# EAGLE design TiLDE (EAGLE 6.1)
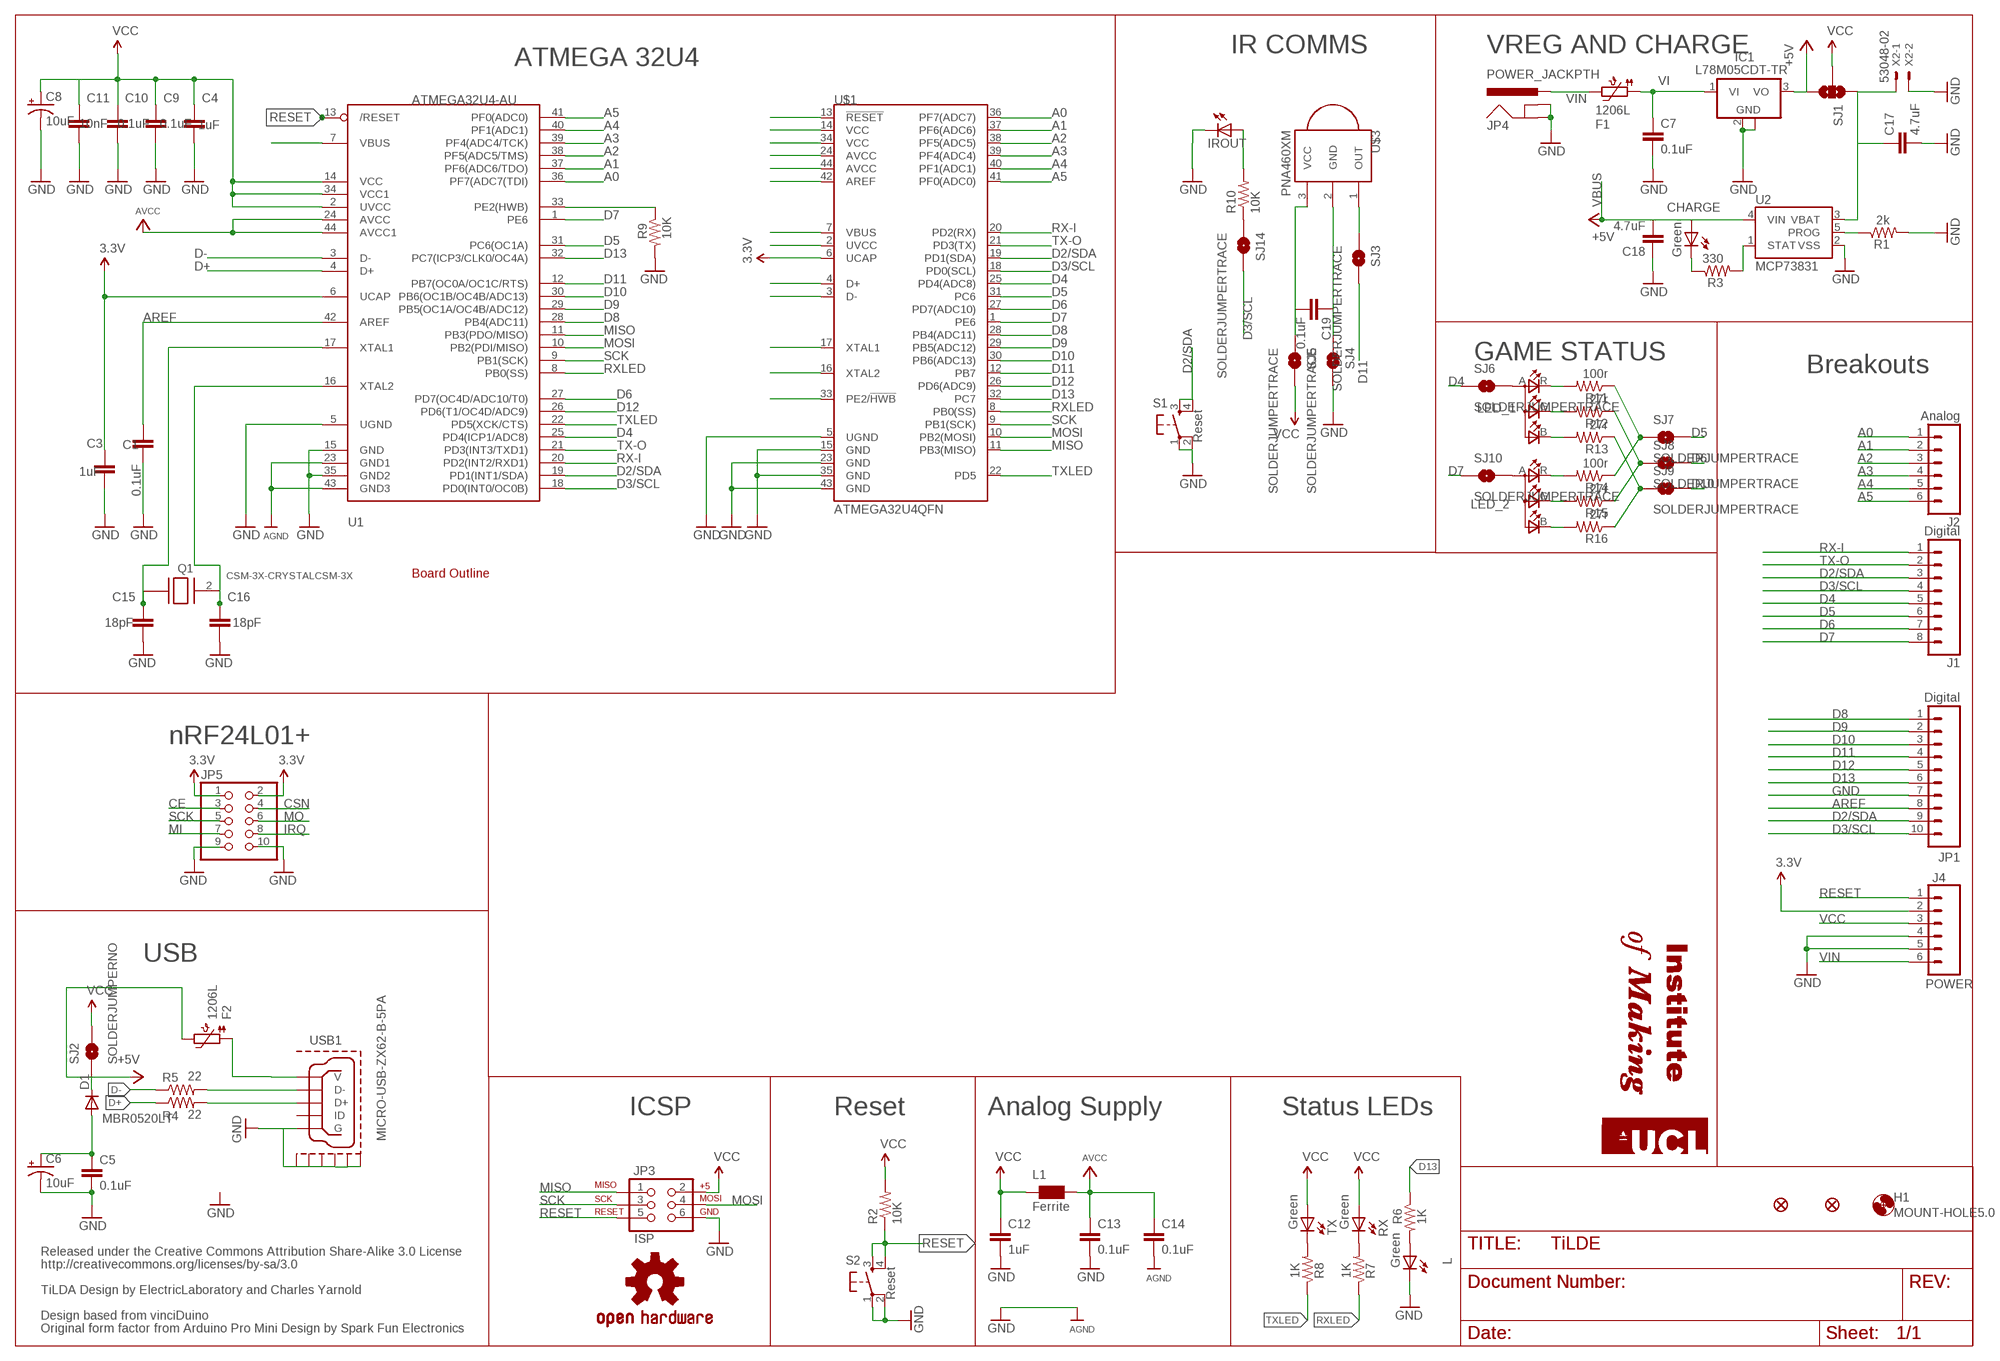
[diagram p0: schematic, sheet 1]

## Parts
C1  0.1uF  C-EUC0603K  [C0603K]
C3  1uF  C-EUC0603K  [C0603K]
C4  1uF  C-EUC0603K  [C0603K]
C5  0.1uF  C-EUC0603K  [C0603K]
C6  10uF  CAP_POL1206  [EIA3216]
C7  0.1uF  C-EUC0603K  [C0603K]
C8  10uF  CAP_POL1206  [EIA3216]
C9  0.1uF  C-EUC0603K  [C0603K]
C10  0.1uF  C-EUC0603K  [C0603K]
C11  10nF  C-EUC0603K  [C0603K]
C12  1uF  C-EUC0603K  [C0603K]
C13  0.1uF  C-EUC0603K  [C0603K]
C14  0.1uF  C-EUC0603K  [C0603K]
C15  18pF  C-EUC0603K  [C0603K]
C16  18pF  C-EUC0603K  [C0603K]
C17  4.7uF  C-EUC0603K  [C0603K]
C18  4.7uF  C-EUC0603K  [C0603K]
C19  0.1uF  C-EUC0603K  [C0603K]
CHARGE  Green  LED1206  [LED-1206]
D1  MBR0520LT  [SOD123]
F1  1206L  PTC1206_L  [1206_PTC]
F2  1206L  PTC1206_L  [1206_PTC]
H1  MOUNT-HOLE5.0  [5,0]
IC1  L78M05CDT-TR  78XX  [SOT-223-DPAK]
IROUT  LED5MM  [LED5MM]
J1  Digital  M081X08  [1X08]
J2  Analog  M06SIP  [1X06]
J4  POWER  M06SIP  [1X06]
JP1  Digital  M10"  [1X10]
JP2  FIDUCIAL1X2.5  [FIDUCIAL-1X2.5]
JP3  ISP  AVR_SPI_PRG_6PTH  [2X3]
JP4  POWER_JACKPTH  [POWER_JACK_PTH]
JP5  PINHD-2X5  [2X05]
JP6  FIDUCIAL1X2.5  [FIDUCIAL-1X2.5]
L  Green  LED1206  [LED-1206]
L1  Ferrite  WE-CBF_1206W  [1206W]
LED_1  CLV1A-FKB  [CLV1A-FKB]
LED_2  CLV1A-FKB  [CLV1A-FKB]
Q1  CSM-3X-CRYSTALCSM-3X  [CSM-3X]
R1  2k  RESISTOR0603-RES  [0603-RES]
R2  10K  RESISTOR0603-RES  [0603-RES]
R3  330  RESISTOR0603-RES  [0603-RES]
R4  22  RESISTOR0603-RES  [0603-RES]
R5  22  RESISTOR0603-RES  [0603-RES]
R6  1K  RESISTOR0603-RES  [0603-RES]
R7  1K  RESISTOR0603-RES  [0603-RES]
R8  1K  RESISTOR0603-RES  [0603-RES]
R9  10K  RESISTOR0603-RES  [0603-RES]
R10  10K  RESISTOR0603-RES  [0603-RES]
R11  100r  RESISTOR0603-RES  [0603-RES]
R12  27r  RESISTOR0603-RES  [0603-RES]
R13  27r  RESISTOR0603-RES  [0603-RES]
R14  100r  RESISTOR0603-RES  [0603-RES]
R15  27r  RESISTOR0603-RES  [0603-RES]
R16  27r  RESISTOR0603-RES  [0603-RES]
RX  Green  LED1206  [LED-1206]
S1  Reset  TAC_SWITCHSMD  [TACTILE_SWITCH_SMD]
S2  Reset  TAC_SWITCHSMD  [TACTILE_SWITCH_SMD]
SJ1  SOLDERJUMPER_2WAYT  [SJ_2]
SJ2  SOLDERJUMPERNO  [SJ_2S-NO]
SJ3  SOLDERJUMPERTRACE  [SJ_2S-TRACE]
SJ4  SOLDERJUMPERTRACE  [SJ_2S-TRACE]
SJ5  SOLDERJUMPERTRACE  [SJ_2S-TRACE]
SJ6  SOLDERJUMPERTRACE  [SJ_2S-TRACE]
SJ7  SOLDERJUMPERTRACE  [SJ_2S-TRACE]
SJ8  SOLDERJUMPERTRACE  [SJ_2S-TRACE]
SJ9  SOLDERJUMPERTRACE  [SJ_2S-TRACE]
SJ10  SOLDERJUMPERTRACE  [SJ_2S-TRACE]
SJ14  SOLDERJUMPERTRACE  [SJ_2S-TRACE]
TX  Green  LED1206  [LED-1206]
U1  ATMEGA32U4-AU  [TQFP44]
U2  MCP73831  [SOT23-5]
U$1  ATMEGA32U4QFN  [QFN-44]
U$2  UCL-LOGO  [UCL-LOGO]
U$3  PNA460XM  [PNA460XM]
U$5  BOARDOUTLINE  [BADGEBOARDBARE]
U$14  OSHW-LOGOS  [OSHW-LOGO-S]
USB1  MICRO-USB-ZX62-B-5PA  [ZX62-B-5PA]
X2  53048-02  [53048-02]

## Nets
3.3V: C3.1 J4.2 JP5.1 JP5.2 U1.6(UCAP) U$1.6(UCAP)
+5V: IC1.3(VO) SJ1.3
A0: J2.1 JP5.3 U1.36(PF7(ADC7(TDI)) U$1.36(PF7(ADC7))
A1: J2.2 JP5.4 U1.37(PF6(ADC6/TDO)) U$1.37(PF6(ADC6))
A2: J2.3 U1.38(PF5(ADC5/TMS)) U$1.38(PF5(ADC5))
A3: J2.4 U1.39(PF4(ADC4/TCK)) U$1.39(PF4(ADC4))
A4: J2.5 U1.40(PF1(ADC1)) U$1.40(PF1(ADC1))
A5: J2.6 U1.41(PF0(ADC0)) U$1.41(PF0(ADC0))
AREF: C1.2 JP1.8 U1.42(AREF) U$1.42(AREF)
AVCC: C13.1 C14.1 L1.2 U1.24(AVCC) U1.44(AVCC1) U$1.24(AVCC) U$1.44(AVCC)
D2: JP5.8
D2/SDA: J1.3 JP1.9 S1.3 S1.4 U1.19(PD1(INT1/SDA)) U$1.19(PD1(SDA))
D3/SCL: J1.4 JP1.10 SJ14.2 U1.18(PD0(INT0/OC0B)) U$1.18(PD0(SCL))
D4: J1.5 SJ6.1 U1.25(PD4(ICP1/ADC8)) U$1.25(PD4(ADC8))
D5: J1.6 SJ7.2 U1.31(PC6(OC1A)) U$1.31(PC6)
D6: J1.7 SJ8.2 U1.27(PD7(OC4D/ADC10/T0)) U$1.27(PD7(ADC10))
D7: J1.8 SJ10.1 U1.1(PE6) U$1.1(PE6)
D8: JP1.1 U1.28(PB4(ADC11)) U$1.28(PB4(ADC11))
D9: JP1.2 U1.29(PB5(OC1A/OC4B/ADC12)) U$1.29(PB5(ADC12))
D10: JP1.3 SJ9.2 U1.30(PB6(OC1B/OC4B/ADC13)) U$1.30(PB6(ADC13))
D11: JP1.4 SJ3.2 U1.12(PB7(OC0A/OC1C/RTS)) U$1.12(PB7)
D12: JP1.5 U1.26(PD6(T1/OC4D/ADC9)) U$1.26(PD6(ADC9))
D13: JP1.6 R6.1 U1.32(PC7(ICP3/CLK0/OC4A)) U$1.32(PC7)
D+: R4.1 U1.4(D+) U$1.4(D+)
D-: R5.1 U1.3(D-) U$1.3(D-)
GND: C1.1 C3.2 C4.2 C5.2 C6.C(-) C7.2 C8.C(-) C9.2 C10.2 C11.2 C12.2 C13.2 C14.2 C15.2 C16.2 C17.2 C18.1 IC1.2(GND) IC1.4(GND) IROUT.K(C) J4.4 J4.5 JP1.7 JP3.6 JP4.GND JP4.GNDBREAK JP5.9 JP5.10 L.C R1.2 R9.2 S1.1 S1.2 S2.1 S2.2 SJ4.2 U1.5(UGND) U1.15(GND) U1.23(GND1) U1.35(GND2) U1.43(GND3) U2.2(VSS) U$1.5(UGND) U$1.15(GND) U$1.23(GND) U$1.35(GND) U$1.43(GND) USB1.5(G) USB1.GND@1(GND1) USB1.GND@2(GND2) USB1.GND@3(GND3) USB1.GND@4(GND4) USB1.GND@5(GND5) USB1.GND@6(GND6) X2.2 ; supply symbol labelled AGND
HWB: R9.1 U1.33(PE2(HWB)) U$1.33(PE2/!HWB)
MISO: JP3.1 JP5.7 U1.11(PB3(PDO/MISO)) U$1.11(PB3(MISO))
MOSI: JP3.4 JP5.6 U1.10(PB2(PDI/MISO)) U$1.10(PB2(MOSI))
N$1: R8.2 TX.C
N$2: R5.2 USB1.2(D-)
N$3: C19.1 SJ4.1 U$3.2(GND)
N$4: C19.2 SJ5.1 U$3.3(VCC)
N$5: R4.2 USB1.3(D+)
N$6: SJ3.1 U$3.1(OUT)
N$7: L.A R6.2
N$8: C17.1 SJ1.1 U2.3(VBAT) X2.1
N$9: R7.2 RX.C
N$10: R1.1 U2.5(PROG)
N$11: R3.2 U2.1(STAT)
N$12: CHARGE.C R3.1
N$13: F2.1 USB1.1(V)
N$14: LED_1.R(CRED) R11.2
N$15: LED_1.G(CGREEN) R12.2
N$16: LED_1.B(CBLUE) R13.2
N$17: LED_2.R(CRED) R14.2
N$18: LED_2.G(CGREEN) R15.2
N$19: LED_2.B(CBLUE) R16.2
N$20: R11.1 R14.1 SJ7.1
N$21: R12.1 R15.1 SJ8.1
N$22: R13.1 R16.1 SJ9.1
N$23: LED_2.A(ANODE) SJ10.2
N$24: C5.1 C6.A(+) D1.A
N$27: LED_1.A(ANODE) SJ6.2
N$28: R10.1 SJ14.1
N$29: IROUT.A R10.2
RESET: J4.1 JP3.5 R2.1 S2.3 S2.4 U1.13(/RESET) U$1.13(!RESET)
RX-I: J1.1 U1.20(PD2(INT2/RXD1)) U$1.20(PD2(RX))
RXLED: R7.1 U1.8(PB0(SS)) U$1.8(PB0(SS))
SCK: JP3.3 JP5.5 U1.9(PB1(SCK)) U$1.9(PB1(SCK))
TX-O: J1.2 U1.21(PD3(INT3/TXD1)) U$1.21(PD3(TX))
TXLED: R8.1 U1.22(PD5(XCK/CTS)) U$1.22(PD5)
VBUS: C18.2 CHARGE.A D1.C F2.2 SJ2.1 U1.7(VBUS) U2.4(VIN) U$1.7(VBUS) ; supply symbol labelled +5V
VCC: C4.1 C8.A(+) C9.1 C10.1 C11.1 C12.1 J4.3 JP3.2 L1.1 R2.2 RX.A SJ1.2 SJ2.2 SJ5.2 TX.A U1.2(UVCC) U1.14(VCC) U1.34(VCC1) U$1.2(UVCC) U$1.14(VCC) U$1.34(VCC)
VI [vcc]: C7.1 F1.1 IC1.1(VI)
VIN [vcc]: F1.2 J4.6 JP4.PWR
XTAL1: C15.1 Q1.1 U1.17(XTAL1) U$1.17(XTAL1)
XTAL2: C16.1 Q1.2 U1.16(XTAL2) U$1.16(XTAL2)
Unconnected: USB1.4(ID)

## Notes on the sheet
- IR COMMS | VREG AND CHARGE
- ATMEGA 32U4
- VBUS
- GAME STATUS
- Breakouts
- nRF24L01+
- CE | CSN
- SCK | MO
- MI | IRQ
- USB
- ICSP | Reset | Analog Supply | Status LEDs
- Released under the Creative Commons Attribution Share-Alike 3.0 License
- http://creativecommons.org/licenses/by-sa/3.0
- TiLDA Design by ElectricLaboratory and Charles Yarnold
- Design based from vinciDuino
- Original form factor from Arduino Pro Mini Design by Spark Fun Electronics

## Library data of the parts
C1 C3-C5 C7 C9-C19 = resistor:C-EU: CAPACITOR, European symbol
C6 C8 = SparkFun:CAP_POL: Capacitor Polarized These are standard SMD and PTH capacitors. Normally 10uF, 47uF, and 100uF in electrolytic and tantalum varieties. Always verify the external diameter of the through hole cap, it varies with capacity, voltage, and manufacturer. The EIA devices should be standard.
CHARGE L RX TX = SparkFun:LED: LEDs Standard schematic elements and footprints for 5mm, 3mm, 1206, and 0603 sized LEDs. 5mm - Spark Fun Electronics SKU : COM-00529 (and others)
D1 = diode:MBR0520LT: SCHOTTKY BARRIER RECTIFIER Source: http://onsemi.com .. MBR0520LT1-D.pdf
F1 F2 = microbuilder:PTC: PTC (Resettable Fuse) 1206 Package 250mA PTC (16V Max, Time-to-Trip: 0.08s) - Digikey: F2110CT-ND 1210 Package 100mA PTC (30V Max, Time-to-Trip: 0.6s) - Digikey: MF-USMF010-2CT-ND 1812 Package 750mA PTC (24V Max, Time-to-Trip: 0.2s) - Digikey: MF-MSMF075/24-2CT-ND
H1 = holes:MOUNT-HOLE: MOUNTING HOLE with drill center marker
IC1 = fmc:78XX
IROUT = SparkFun-LED:LED: LEDs Standard schematic elements and footprints for 5mm, 3mm, 1206, and 0603 sized LEDs. 5mm - Spark Fun Electronics SKU : COM-00529 (and others)
J1 = SparkFun:M08: Header 8 Standard 8-pin 0.1" header. Use with straight break away headers (SKU : PRT-00116), right angle break away headers (PRT-00553), swiss pins (PRT-00743), machine pins (PRT-00117), and female headers (PRT-00115).
J2 J4 = SparkFun:M06: Header 6 Standard 6-pin 0.1" header. Use with straight break away headers (SKU : PRT-00116), right angle break away headers (PRT-00553), swiss pins (PRT-00743), machine pins (PRT-00117), and female headers (PRT-00115). Molex polarized connector foot print use with SKU : PRT-08094 with associated crimp pins and housings. NOTES ON THE VARIANTS LOCK and LOCK_LONGPADS... This footprint was designed to help hold the alignment of a through-hole component (i.e. 6-pin header) while soldering it into place. You may notice that each hole has been shifted either up or down by 0.005 of an inch from it's more standard position (which is a perfectly straight line). This slight alteration caused the pins (the squares in the middle) to touch the edges of the holes. Because they are alternating, it causes a "brace" to hold the component in place. 0.005 has proven to be the perfect amount of "off-center" position when using our standard breakaway headers. Although looks a little odd when you look at the bare footprint, once you have a header in there, the alteration is very hard to notice. Also, if you push a header all the way into place, it is covered up entirely on the bottom side. This idea of altering the position of holes to aid alignment will be further integrated into the Sparkfun Library for other footprints. It can help hold any component with 3 or more connection pins.
JP1 = SparkFun:M10: Header 10 Standard 10-pin 0.1" header. Use with straight break away headers (SKU : PRT-00116), right angle break away headers (PRT-00553), swiss pins (PRT-00743), machine pins (PRT-00117), and female headers (PRT-00115).
JP2 JP6 = SparkFun-Aesthetics:FIDUCIAL: Fiducial Alignment Points Various fiducial points for machine vision alignment.
JP3 = SparkFun:AVR_SPI_PRG_6: AVR ISP 6 Pin This is the reduced ISP connector for AVR programming. Common on Arduino. This footprint will take up less PCB space and can be used with a 10-pin to 6-pin adapter such as SKU: BOB-08508
JP4 = SparkFun:POWER_JACK: Power Jack This is the standard 5.5mm barrel jack for power. The PTH is the most common, proven, reliable, footprint. All others are experimental. The Slot footprint only works if the mill layer is transmitted to the PCB fab house so be warned. Spark Fun Electronics SKU : PRT-00119. Mating wall wart : TOL-00298 (and others)
JP5 = pinhead:PINHD-2X5: PIN HEADER
L1 = wuerth-elektronik:WE-CBF: SMD EMI Suppression Ferrite Beads - excellent anti-EMI properties - low DCR - impedances till 3000 ohms - rated current up to 6 A
LED_1 LED_2 = led-rgb:CLV1A-FKB: Chip LED RGB Source: http://document.sharpsma.com/files/GM1WA55311A_SS.pdf
Q1 = fmc:CSM-3X-CRYSTAL
R1-R16 = SparkFun-Passives:RESISTOR: Resistor Basic schematic elements and footprints for 0603, 1206, and PTH resistors.
S1 S2 = SparkFun:TAC_SWITCH: Momentary Switch Button commonly used for reset or general input. Spark Fun Electronics SKU : COM-00097
SJ1 = SparkFun-Passives:SOLDERJUMPER_2WAY: Solder Jumper 2 way solder jumper
SJ2-SJ10 SJ14 = SparkFun-Passives:SOLDERJUMPER: Solder Jumper Standard SMD solder jumper. Used to automate production. Two varients : Normally Open and Normally Closed are the same, but have different paste layers. NC will have a large amount of paste and should jumper during reflow.
U1 = adafruit:ATMEGA32U4: http://www.ladyada.net/library/eagle
U2 = SparkFun-PowerIC:MCP73831: Miniature single cell, fully integrated Li-Ion, Li-polymer charge management controller http://ww1.microchip.com/downloads/en/DeviceDoc/21984a.pdf
U$1 = SparkFun-DigitalIC:ATMEGA32U4: Atmel 44-pin 8-bit Microcontroller with 32KBytes of ISP Flash and USB Controller
U$2 = TiLDA:UCL-LOGO
U$3 = adafruit:PNA460XM: IR 38KHz receiver PNA4602 and related receivers http://www.ladyada.net/library/pcb/eaglelibrary.html
U$5 = TiLDA:BOARDOUTLINE
U$14 = SparkFun:OSHW-LOGO: Open Source Hardware Logo This logo indicates the piece of hardware it is found on incorporates a OSHW license and/or adheres to the definition of open source hardware found here: http://freedomdefined.org/OSHW
USB1 = serial:MICRO-USB: MICRO USB B, BOTTOM MOUNT
X2 = con-molex:53?-02: CONNECTOR wire to board 1.25 mm (.049 inch) pitch header; MF: MOLEX; MPN: 53048-0210; OC_FARNELL: 1012259; OC_NEWARK: 57H4718

## Net classes
1 vcc: width 0.254 mm

## Board
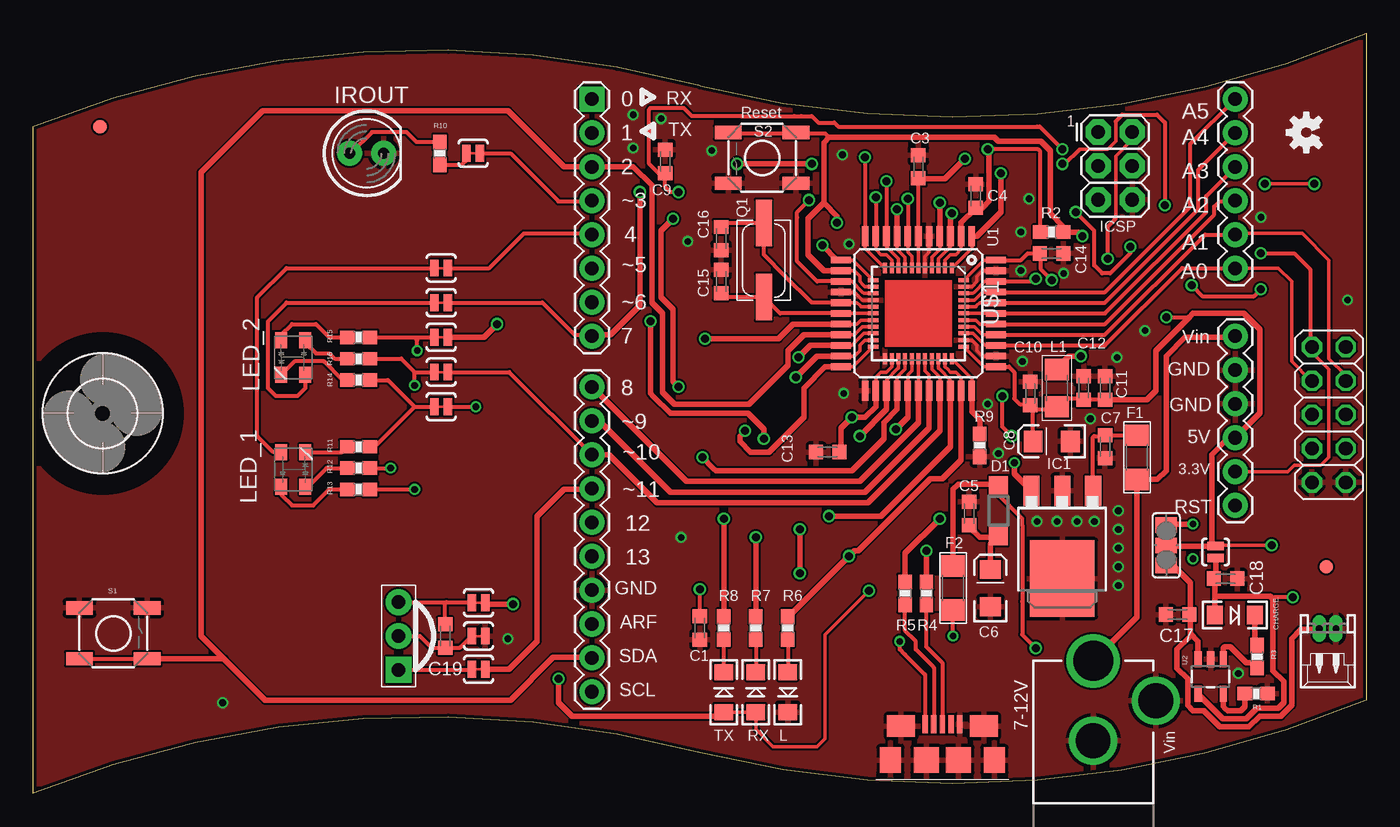
[diagram p1: board, top side]
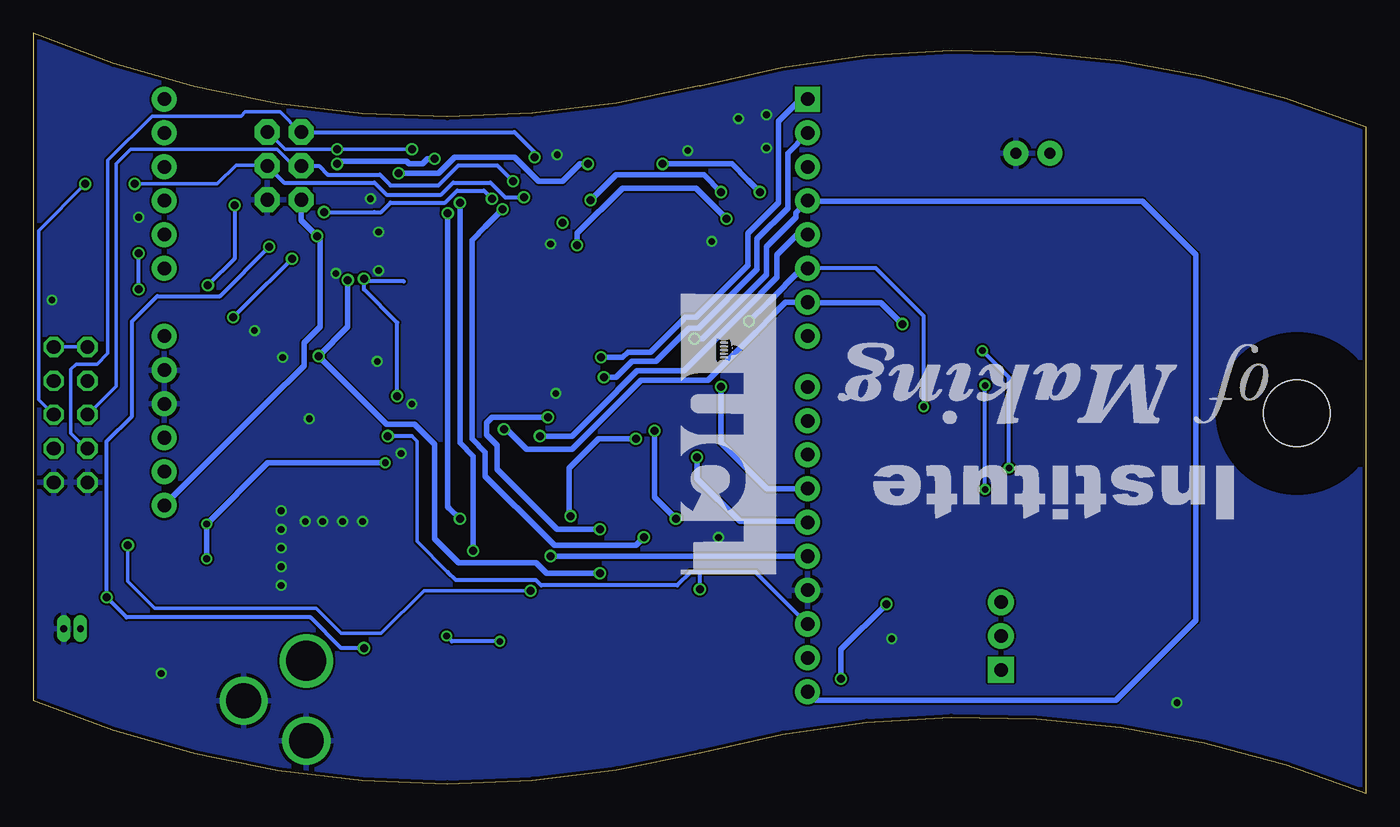
[diagram p2: board, bottom side, seen from below]

Size 100 x 57 mm. Coordinates in mm from the lower left corner, seen from the top.
Copper layers (1*16): Top 0.035mm / dielectric 1.5mm / Bottom 0.035mm
Design rules: minimum track width 6mil, minimum drill 12mil, track to track 6mil, track to pad 6mil, pad to pad 6mil, via to via 6mil, smd to smd 0mil, copper to edge 10mil, drill to drill 10mil, minimum pad ring 10mil, minimum via ring 6mil, stop-mask expansion 2mil, vias tented up to drill 100mil, thermal gap 10mil

### Footprints (pad centres in the part's own frame; a part is rotated, then mirrored left to right if it is on the bottom)
C0603K = smd 1.05 x 1.08: 1 -0.875,0; 2 0.875,0
EIA3216 = smd 1.4 x 1.6: A 1.4,0; C -1.4,0
LED-1206 = smd 1.2 x 1.4: A -1.5,0; C 1.5,0
SOD123 = smd 1.4 x 1.4: A 1.9,0; C -1.9,0
1206_PTC = smd 1.6 x 1.8: 1 -1.654,0; 2 1.654,0
5,0 = hole 5: 0,0
SOT-223-DPAK = smd 1.219 x 2.235: 1 -2.311,-3.099; 2 0,-3.099; 3 2.311,-3.099 | smd 4.826 x 5.715: 4 0,3.493
LED5MM = drill 0.813 pad 1.88: A -1.27,0; K 1.27,0
1X08@1 = drill 1.016 pad 1.88 square: 1 0,0 | drill 1.016 pad 1.88: 2 2.54,0; 3 5.08,0; 4 7.62,0; 5 10.16,0; 6 12.7,0; 7 15.24,0; 8 17.78,0
1X06@1 = drill 1.016 pad 1.88: 1 -6.35,0; 2 -3.81,0; 3 -1.27,0; 4 1.27,0; 5 3.81,0; 6 6.35,0
1X10 = drill 1.016 pad 1.88: 1 0,0; 2 2.54,0; 3 5.08,0; 4 7.62,0; 5 10.16,0; 6 12.7,0; 7 15.24,0; 8 17.78,0; 9 20.32,0; 10 22.86,0
FIDUCIAL-1X2.5 = smd 1 x 1: 1 0,0
2X3@1 = drill 1.016 pad 1.88 octagon: 1 0,0; 2 0,2.54; 3 2.54,0; 4 2.54,2.54; 5 5.08,0; 6 5.08,2.54
POWER_JACK_PTH@1 = drill 2.6: GND 0,7.7; GNDBREAK 4.7,10.7 | drill 3: PWR 0,13.7
2X05 = drill 1.016 octagon: 1 -5.08,-1.27; 2 -5.08,1.27; 3 -2.54,-1.27; 4 -2.54,1.27; 5 0,-1.27; 6 0,1.27; 7 2.54,-1.27; 8 2.54,1.27; 9 5.08,-1.27; 10 5.08,1.27
1206W = smd 1.6 x 1.8: 1 -1.4,0; 2 1.4,0
CLV1A-FKB = smd 1.2 x 0.9: A 0.4,-0.4; B 3,-0.4; G 3,1.4; R 0.4,1.4
CSM-3X = smd 3.5 x 1.2: 1 2.775,0; 2 -2.775,0
0603-RES = smd 1.1 x 1: 1 -0.85,0; 2 0.85,0
TACTILE_SWITCH_SMD = smd 2 x 1: 1 -2.54,1.905; 2 2.54,1.905; 3 -2.54,-1.905; 4 2.54,-1.905
TACTILE_SWITCH_SMD@1 = smd 2 x 1: 1 -2.54,1.905; 2 2.54,1.905; 3 -2.54,-1.905; 4 2.54,-1.905
SJ_2 = smd 1.168 x 1.6: 1 -1.524,0; 2 0,0; 3 1.524,0
SJ_2S-NO = smd 0.635 x 1.27: 1 -0.45,0; 2 0.45,0
SJ_2S-TRACE = smd 0.635 x 1.27: 1 -0.508,0; 2 0.508,0
TQFP44 = smd 1.5 x 0.5: 1 -5.8,4; 2 -5.8,3.2; 3 -5.8,2.4; 4 -5.8,1.6; 5 -5.8,0.8; 6 -5.8,0; 7 -5.8,-0.8; 8 -5.8,-1.6; 9 -5.8,-2.4; 10 -5.8,-3.2; 11 -5.8,-4; 23 5.8,-4; 24 5.8,-3.2; 25 5.8,-2.4; 26 5.8,-1.6; 27 5.8,-0.8; 28 5.8,0; 29 5.8,0.8; 30 5.8,1.6; 31 5.8,2.4; 32 5.8,3.2; 33 5.8,4 | smd 0.5 x 1.5: 12 -4,-5.8; 13 -3.2,-5.8; 14 -2.4,-5.8; 15 -1.6,-5.8; 16 -0.8,-5.8; 17 0,-5.8; 18 0.8,-5.8; 19 1.6,-5.8; 20 2.4,-5.8; 21 3.2,-5.8; 22 4,-5.8; 34 4,5.8; 35 3.2,5.8; 36 2.4,5.8; 37 1.6,5.8; 38 0.8,5.8; 39 0,5.8; 40 -0.8,5.8; 41 -1.6,5.8; 42 -2.4,5.8; 43 -3.2,5.8; 44 -4,5.8
SOT23-5 = smd 0.55 x 1.2: 1 -0.95,-1.3; 2 0,-1.3; 3 0.95,-1.3; 4 0.95,1.3; 5 -0.95,1.3
QFN-44 = smd 0.8 x 0.3: 1 -3.4,2.5; 2 -3.4,2; 3 -3.4,1.5; 4 -3.4,1; 5 -3.4,0.5; 6 -3.4,0; 7 -3.4,-0.5; 8 -3.4,-1; 9 -3.4,-1.5; 10 -3.4,-2; 11 -3.4,-2.5; 23 3.4,-2.5; 24 3.4,-2; 25 3.4,-1.5; 26 3.4,-1; 27 3.4,-0.5; 28 3.4,0; 29 3.4,0.5; 30 3.4,1; 31 3.4,1.5; 32 3.4,2; 33 3.4,2.5 | smd 0.3 x 0.8: 12 -2.5,-3.4; 13 -2,-3.4; 14 -1.5,-3.4; 15 -1,-3.4; 16 -0.5,-3.4; 17 0,-3.4; 18 0.5,-3.4; 19 1,-3.4; 20 1.5,-3.4; 21 2,-3.4; 22 2.5,-3.4; 34 2.5,3.4; 35 2,3.4; 36 1.5,3.4; 37 1,3.4; 38 0.5,3.4; 39 0,3.4; 40 -0.5,3.4; 41 -1,3.4; 42 -1.5,3.4; 43 -2,3.4; 44 -2.5,3.4
PNA460XM = drill 1.016 pad 1.93 square: 1 -2.54,0 | drill 1.016 pad 1.93: 2 0,0; 3 2.54,0
ZX62-B-5PA = smd 0.4 x 1.35: 1 -1.3,2.675; 2 -0.65,2.675; 3 0,2.675; 4 0.65,2.675; 5 1.3,2.675 | smd 2.1 x 1.6: GND@1 -3.1,2.55; GND@2 3.1,2.55 | smd 1.6 x 1.9: GND@3 3.9,0; GND@6 -3.9,0 | smd 1.9 x 1.9: GND@4 1.2,0; GND@5 -1.2,0
53048-02 = drill 0.5 pad 0.698 long: 1 0.625,-1.25; 2 -0.625,-1.25

### Placement (x,y rotation side)
C1  50,12.4 90 top
C3  66.4,47 90 top
C4  70.7,44.8 90 top
C5  70.2,21 90 top
C6  71.8,15.4 90 top
C7  80.4,26 270 top
C8  76.4,26.4 180 top
C9  47.4,47.4 90 top
C10  74.8,30 90 top
C11  80.4,30.4 90 top
C12  78.8,30.4 90 top
C13  59.6,25.6 180 top
C14  76.4,40.5 0 top
C15  51.6,38.4 90 top
C16  51.6,41.6 270 top
C17  85.86,13.4 180 top
C18  89.45,16.1 180 top
C19  30.9,11.8 90 top
CHARGE  90.14,13.37 0 top
D1  72.4,21.2 270 top
F1  82.8,25.2 270 top
F2  69,15.4 90 top
H1  5.2,28.5 0 top
IC1  77.2,19.6 180 top
IROUT  25,48 0 top
J1  Digital  [1X08@1]  41.91,52.07 270 top
J2  Analog  [1X06@1]  90.17,45.72 90 top
J4  POWER  [1X06@1]  90.17,27.94 90 top
JP1  41.91,30.48 270 top
JP2  5,50 0 top
JP3  ISP  [2X3@1]  79.9,49.6 270 top
JP4  POWER_JACKPTH  [POWER_JACK_PTH@1]  79.52,-3.76 0 top
JP5  97.2,28.4 270 top
JP6  97,17 0 top
L  56.6,7.6 270 top
L1  76.8,30.4 90 top
LED_1  19,26 270 top
LED_2  20,31 90 top
Q1  54.8,40 270 top
R1  91.75,7.48 0 top
R2  76.4,42.1 180 top
R3  91.81,10.26 270 top
R4  67,15 270 top
R5  65.4,15 270 top
R6  56.6,12.4 270 top
R7  54.2,12.4 270 top
R8  51.8,12.4 270 top
R9  71,26.1 270 top
R10  30.5,48 90 top
R11  24.4,26 180 top
R12  24.4,24.4 180 top
R13  24.4,22.8 180 top
R14  24.4,31 180 top
R15  24.4,34.2 180 top
R16  24.4,32.6 180 top
RX  54.2,7.6 90 top
S1  6,12 0 top
S2  Reset  [TACTILE_SWITCH_SMD@1]  54.68,47.66 180 top
SJ1  85,18.6 90 top
SJ2  88.7,18.1 90 top
SJ3  33.4,9.3 0 top
SJ4  33.4,11.8 0 top
SJ5  33.4,14.3 0 top
SJ6  30.6,39.4 180 top
SJ7  30.6,29 0 top
SJ8  30.6,34.2 0 top
SJ9  30.6,31.6 0 top
SJ10  30.6,36.8 180 top
SJ14  33,48 0 top
TX  51.8,7.6 90 top
U1  66.4,36 270 top
U2  88.33,8.76 180 top
U$1  66.4,36 270 top
U$2  51.4,37.5 270 bottom
U$3  27.4,11.8 90 top
U$5  0,0 0 top
U$14  95.5,49.56 90 top
USB1  68.2,2.5 0 top
X2  97.1,11.1 180 top

### Tracks (layer width: path | path; a pad name or v marks a point on that pad's centre or on a via)
3.3V  (via drill 0.6)
  Top 0.254: U1.6 U$1.6 | J4.2 94.13,24.13 94.6,24.6 96.6,24.6 97.2,25.2 97.2,31.8 96,33 96,33.41 JP5.1 | 78.5,48.3 80.6,48.3 81.2,48.9 81.2,50.4
  Top 0.305: U1.6 66.4,43.2 66.4,46 66.4,46.1 C3.1 | v77.2,47.2 77.4,47.2 78.5,48.3 | 81.2,50.4 81.7,50.9 84.3,50.9 84.9,50.3 v84.9,44.1 | v86.9,38.1 87.7,37.3 91.6,37.3 v92.1,37.8 | v92.1,40.5 94.6,40.5 95.8,39.3 95.8,33.6 95.9,33.5 95.91,33.5 JP5.1
  Top 0.406: 66.4,46.1 68.4,46.1 v69.9,47.6
  Bottom 0.254: JP5.2 JP5.1
  Bottom 0.305: v84.9,44.1 84.9,40.1 v86.9,38.1 | v92.1,37.8 v92.1,40.5
  Bottom 0.406: v69.9,47.6 70.4,47.6 70.8,47.2 71.8,47.2 72,47.4 77,47.4 v77.2,47.2
+5V  (via drill 0.5)
  Top 0.406: 74.49,23.1 IC1.3 73.6,23.99 v73.6,24.8 | SJ1.3 85.08,20.2 v87,20.2 | v87,17.6 87.05,17.65
  Bottom 0.406: v87,17.6 v87,20.2 82.4,24.8 81.4,24.8 v73.6,24.8
A0
  Top 0.254: U1.36 71.4,33.6 70.6,34.4 70.5,34.5 U$1.36 | JP5.3 95.86,30.94 94.4,32.4 94.4,38.4 93.4,39.4 90.2,39.4 J2.1
  Top 0.305: U1.36 80.4,33.6 86.2,39.4 90.2,39.4
A1
  Top 0.254: U1.37 71.2,34.4 70.8,34.8 70.6,35 U$1.37 | JP5.4 98.46,31.34 97.2,32.6 97.2,40 95.2,42 90.8,42 90.6,41.8 90.4,42 90.4,41.8 90.2,42 90.2,41.94 J2.2
  Top 0.305: U1.37 80.4,34.4 87.8,41.8 87.91,41.91 J2.2
A2
  Top 0.254: U1.38 71,35.2 70.8,35.4 70.7,35.5 U$1.38
  Top 0.305: U1.38 80.4,35.2 88.6,43.4 88.6,44 89,44.4 90.12,44.4 J2.3
A3
  Top 0.254: U1.39 U$1.39
  Top 0.305: U1.39 80.4,36 88,43.6 88,44.8 90.2,47
  Top 0.406: 90.2,47 90.19,46.99 J2.4
A4
  Top 0.254: U1.40 71,36.8 70.8,36.6 70.7,36.5 U$1.40
  Top 0.305: U1.40 80.4,36.8 87.4,43.8 87.4,46.76 J2.5
A5
  Top 0.254: U1.41 71.2,37.6 70.6,37 U$1.41
  Top 0.305: U1.41 80.4,37.6 86.8,44 86.8,48.7 J2.6
AREF  (via drill 0.6)
  Top 0.254: U1.42 71.4,38.4 70.6,37.6 70.5,37.5 U$1.42
  Top 0.305: 73.6,38.4 U1.42 75,38.4 v75.2,38.6 | v73.4,26.8 72.7,27.5 v72.7,29.8 | C1.2 v50,15.3
  Bottom 0.254: 68.9,16.6 71.2,18.9 71.2,26.4 71.6,26.8
  Bottom 0.305: JP1.8 45.81,16.6 50,16.6 | U1.42 75,38.4 v75.2,38.6 75.2,37.8 72.7,35.3 v72.7,29.8 | 71.6,26.8 v73.4,26.8 | v50,15.3 50,16.6 | 50,16.6 50.7,16.6 51.7,15.6 61.9,15.6 62.3,16 68.3,16 68.9,16.6
AVCC  (via drill 0.6)
  Top 0.254: U1.44 71.3,40 U$1.44 | U1.24 63.2,31.2 63.6,31.6 64,31.6 64.4,32 U$1.24
  Top 0.305: v76.4,38.5 76,38.9 75.6,39.3 75.6,40.42 C14.1 74.6,40.5 74.1,40 U1.44
  Top 0.406: U1.24 63.2,29 62.4,28.2 v61.4,28.2 60.6,27.4 60.6,25.73 C13.1 | L1.2 76.8,31.9 77.7,32.8 v78.6,32.8 | v57.5,16.5 v57.5,19.8
  Bottom 0.406: v76.4,38.5 76.4,35 v78.6,32.8 73.5,27.7 72.7,27.7 71.4,27.7 69.9,26.2 69.9,19.1 68.1,17.3 62.8,17.3 62.3,17.3 61.5,16.5 v57.5,16.5 | v61.4,28.2 65.6,28.2 66,27.8 66,26.9 65.2,26.1 65.2,24.3 60.9,20 60.7,19.8 v57.5,19.8
D2/SDA
  Top 0.254: U1.19 61.6,34.4 62.2,35 U$1.19
  Top 0.305: S1.3 S1.4 | 41.84,10.1 JP1.9
  Top 0.406: S1.4 14.3,10.1 14.4,10 | 14.4,10 17.4,7 35.8,7 39,10.2 41.87,10.2 JP1.9 | U1.19 57.8,34.4 56.6,33.2 56.6,32.1 53.7,29.2 48.1,29.2 47.2,30.1 47.2,36 46.4,36.8 46.4,42.6 46.4,45.6 45,47 42,47 | 42,47 J1.3 | 42,47 41.8,47 39.8,47 35.6,51.2 17.2,51.2 12.6,46.6 12.6,11.8 14.4,10 | 42,47 42,46.8 42,47
D3/SCL  (via drill 0.6)
  Top 0.254: U1.18 61.8,35.2 62,35.4 62.1,35.5 U$1.18
  Top 0.305: SJ14.2 35.8,48 39.4,44.4 41.86,44.4 J1.4
  Top 0.406: U1.18 57,35.2 55.9,34.1 v50.4,34.1
  Bottom 0.406: J1.4 41.96,44.4 J1.4 | JP1.10 41.29,7 18.8,7 12.8,13 12.8,40.4 16.8,44.4 41.4,44.4 41.45,44.45 J1.4 | 42,44.4 41.95,44.45 J1.4 | v50.4,34.1 49.8,34.1 45,38.9 45,41 42.8,43.2 42.8,43.56 J1.4
D4  (via drill 0.6)
  Top 0.254: U1.25 64,31 64.8,31.8 64.9,31.9 U$1.25
  Top 0.305: SJ6.1 34.2,39.4 36.8,42 41.82,42 J1.5
  Top 0.406: v62,26.8 64,28.8 U1.25
  Bottom 0.406: v62,26.8 59.6,26.8 57.2,29.2 55.2,31.2 54.7,31.7 51.2,31.7 46.7,36.2 44.2,38.7 44.2,40.4 42.69,41.91 J1.5
D5  (via drill 0.5, 0.6)
  Top 0.254: U1.31 68.8,31 68,31.8 67.9,31.9 U$1.31
  Top 0.305: SJ7.2 v33.2,29
  Top 0.406: U1.31 68.8,26 67.8,25 63.6,20.8 v59.7,20.8 | v54.8,26.6 54.8,27.3 53.6,28.5 47.8,28.5 46.5,29.8 46.3,30 v46.3,35.4
  Bottom 0.305: v33.2,29 33.2,35.8 36.8,39.4 41.88,39.4 J1.6
  Bottom 0.406: v54.8,26.6 57.6,26.6 59.8,24.4 59.8,20.9 v59.7,20.8 | v46.3,35.4 44.9,36.8 42.33,39.37 J1.6
D6  (via drill 0.6)
  Top 0.254: U1.27 65.6,31.4 65.8,31.6 65.9,31.7 U$1.27
  Top 0.406: U1.27 65.6,30 65.6,28.2 v64.7,27.3 | SJ8.2 33.8,34.2 v34.8,35.2
  Bottom 0.406: v64.7,27.3 64.5,27.3 63,25.8 59.6,25.8 54.4,31 49.4,31 45.8,34.6 44.4,36 43.6,36.8 43.57,36.83 J1.7 41.97,36.83 42,36.8 41.8,36.8 36.4,36.8 v34.8,35.2
D7  (via drill 0.6)
  Top 0.254: U1.1 70.4,40.9 U$1.1
  Top 0.305: SJ10.1 38.2,36.8 40.6,34.4 41.8,34.4 J1.8
  Top 0.406: U1.1 70.8,41.8 72.6,43.6 v72.6,46.5 | v58.4,47.2 55.6,47.2 v52.8,47.2 | v45.5,45.1 45.5,36.6 43.3,34.4 42,34.4 | 42,34.4 J1.8 42,34.4 | 42,34.4 41.9,34.4
  Bottom 0.406: v58.4,47.2 59,47.2 59.5,46.7 60.3,45.9 61.6,45.9 62.1,45.9 63.9,47.7 66,47.7 68.4,47.7 69.6,46.5 71.4,46.5 71.5,46.5 v72.6,46.5 | v45.5,45.1 46.4,46 47.6,47.2 v52.8,47.2
D8
  Top 0.254: U1.28 U$1.28
  Top 0.406: JP1.1 45.4,27 49,23.4 52.4,23.4 62,23.4 65.6,27 66.4,27.8 U1.28
D9
  Top 0.254: U1.29 67.2,31.4 67,31.6 66.9,31.7 U$1.29
  Top 0.406: JP1.2 42.46,27.94 44.2,26.2 47.8,22.6 52.2,22.6 62.4,22.6 66,26.2 67.2,27.4 U1.29
D10
  Top 0.254: U1.30 68,31.2 67.4,31.8 U$1.30
  Top 0.305: SJ9.2 35.71,31.6 JP1.3
  Top 0.406: U1.30 68,27.2 66.2,25.4 62.6,21.8 50.8,21.8 46.8,21.8 43.2,25.4 42,25.4 JP1.3
D11  (via drill 0.6)
  Top 0.254: U1.12 61.5,40 U$1.12
  Top 0.406: SJ3.2 35.7,9.3 37.8,11.4 37.8,20.8 39.8,22.8 41.85,22.8 JP1.4 | U1.12 60.3,40 v59.2,41.1 | v48,43.1 47.1,42.2 47.1,40.4 47.1,37.2 48,36.3 48,30.9 v48.4,30.5
  Bottom 0.406: v59.2,41.1 59.2,42 55.8,45.4 50.3,45.4 v48,43.1 | v48.4,30.5 48.4,26.3 45.4,23.3 44.96,22.86 JP1.4
D12  (via drill 0.6)
  Top 0.254: U1.26 64.8,31.2 65.4,31.8 U$1.26
  Top 0.406: v50.2,25.2 51,24.4 51.2,24.2 52,24.2 61.4,24.2 61.6,24.4 63.8,26.6 63.8,27.8 64.8,28.8 U1.26
  Bottom 0.406: JP1.5 41.99,20.4 47,20.4 50.2,23.6 50.2,24 v50.2,25.2
D13  (via drill 0.6)
  Top 0.254: U1.32 69.6,31.2 69.2,31.6 68.8,31.6 68.6,31.8 68.4,32 U$1.32
  Top 0.406: U1.32 69.6,28.8 69.6,25 69.2,24.6 68.2,23.6 67.3,23.6 61.9,18.2 61.6,18.2 v61.2,17.8 56.6,13.2 R6.1
  Bottom 0.406: JP1.6 41.93,17.8 v61.2,17.8
D+  (via drill 0.6)
  Top 0.254: U1.4 68,40.8 67.6,40.4 67.4,40.2 U$1.4
  Top 0.406: R4.1 v67,18.2 | v68,44.3 U1.4
  Bottom 0.406: v67,18.2 67,25.3 68,26.3 v68,44.3
D-  (via drill 0.6)
  Top 0.254: U1.3 68.8,41 68,40.2 67.9,40.1 U$1.3
  Top 0.406: R5.1 65.4,18 v68,20.6 | U1.3 68.8,41.9 68.8,43.4 v68.9,43.5
  Bottom 0.406: v68,20.6 68.8,21.4 68.9,21.5 v68.9,43.5
GND  (via drill 0.5)
  Top 0.254: U1.5 67.2,40.6 67,40.4 66.9,40.3 U$1.5 | U1.35 71.2,32.8 70.8,33.2 70.8,33.6 70.4,34 U$1.35 | U$1.43 70.4,38 70.8,38.4 70.8,38.8 71.2,39.2 U1.43 | U1.15 61.6,37.6 62.2,37 U$1.15
  other vias: 74.1,39.2 81.4,19.8 90.4,9 81.4,18.4 81.4,17 81.4,15.6 81.4,21.2 75.3,20.4 76.8,20.4 78.3,20.4 79.6,20.4 71.6,29.2 74.2,32.4 35.6,11.6 14.2,6.8 60.8,30 77.3,39 61.2,41.2 79.3,28.1 81.3,32.7 72.4,25.5 49.1,41.4 74.7,44.6 83.4,34.7 45,48.4 50.9,48.2 92.1,43.2 98.6,37 48.6,19.2 60.7,47.9 45,50.9 47.1,50.6 74.1,42.1
  pour Top: 0,0 100,0 100,56.8 0,56.8
  pour Bottom: 0,0 100,0 100,56.8 0,56.8
HWB
  Top 0.254: U1.33 70.4,31.1 U$1.33
  Top 0.406: U1.33 70.4,28.65 71,28.05 R9.1
MISO  (via drill 0.6)
  Top 0.254: U1.11 62.4,40.9 U$1.11
  Top 0.305: v62.4,47.7 U1.11
  Bottom 0.254: JP3.1 80,49.6 81.5,51.1 84.1,51.1 84.4,50.8 91.1,50.8 94.4,47.5 94.4,33.5 94.4,33 95.2,32.2 96.5,32.2 96.8,32.2 97.2,31.8 97.2,29.67 97.2,27.2 97.2,27 96,25.8 | 96,25.8 95.9,25.8 95.9,25.9 96,25.8 | 96,25.8 95.99,25.8 JP5.7
  Bottom 0.305: JP3.1 63.9,49.6 62.4,48.1 v62.4,47.7
MOSI  (via drill 0.6)
  Top 0.254: U1.10 63.2,40.8 63.6,40.4 64,40.4 64.2,40.2 64.4,40 64.4,39.6 U$1.10 | v96.1,45.7 v92.4,45.7
  Top 0.305: v63.2,44.7 U1.10
  Bottom 0.254: v92.4,45.7 86.2,45.7 84.8,47.1 82.48,47.1 JP3.4 | JP5.6 99.6,29.53 99.6,34.8 99.6,42.2 v96.1,45.7
  Bottom 0.305: JP3.4 82.44,47.04 81.2,45.8 74.4,45.8 73.5,44.9 69.4,44.9 68.5,45.8 65.7,45.8 64.6,44.7 v63.2,44.7
N$1
  Top 0.305: TX.C R8.2 51.8,11.6
  Top 0.406: R8.2 51.8,11.6
N$2
  Top 0.305: R5.2 65.4,12.2 66.2,11.4 66.2,10.8 67.55,9.45 USB1.2
N$3
  Top 0.305: U$3.2 29,11.8 29.4,11.4 29.88,10.93 C19.1 32.02,10.93 SJ4.1
N$4
  Top 0.305: U$3.3 31,14.34 | 31,14.34 32.85,14.34 SJ5.1 | C19.2 30.9,14.24 31,14.34
N$5
  Top 0.305: 67.1,14.1 67,14 67,11 68.2,9.8 USB1.3 | 67.1,14.1 67,14.1 | R4.2 67.05,14.1 67.1,14.1
N$6
  Top 0.305: U$3.1 32.85,9.26 SJ3.1
N$7
  Top 0.305: R6.2 L.A
N$8
  Top 0.406: 86.8,12 86.8,13.34 C17.1 86.8,13.47 86.8,15.8 85.6,17 85,17 SJ1.1 | 86.8,12 87.38,11.43 U2.3 | 86.8,12 86.8,11.8 85.8,10.8 85.8,9.4 86.6,8.6 86.6,6.6 87,6.2 87.8,6.2 89,5 91.2,5 92,5.8 93.6,5.8 94.4,6.6 94.4,7 94.4,10.8 94.4,11.6 95.1,12.3 96.42,12.3 X2.1
N$9
  Top 0.305: R7.2 RX.C
N$10
  Top 0.406: R1.1 90.89,6.5 90.6,6.2 89.6,6.2 89.4,6.4 89.28,6.53 U2.5
N$11
  Top 0.406: R3.2 91.42,9.8 91,9.8 89.8,11 89.4,11 89.28,10.88 U2.1
N$12
  Top 0.406: R3.1 91.64,11.28 CHARGE.C
N$13  (via drill 0.5)
  Top 0.305: v69,11.8 F2.1 | v65,11.4 65,10.8 65.4,10.4 66.9,8.9 USB1.1
  Bottom 0.305: v65,11.4 68.6,11.4 v69,11.8
N$14
  Top 0.305: LED_1.R 23.15,25.6 R11.2
N$15
  Top 0.305: LED_1.G 20.6,23 22,24.4 R12.2
N$16
  Top 0.305: LED_1.B 18.6,22.4 19.4,21.6 21,21.6 22.2,22.8 R13.2
N$17
  Top 0.305: R14.2 23.2,31 21.8,32.4 19.6,32.4 LED_2.R
N$18
  Top 0.305: LED_2.G 18.6,34.4 19.4,35.2 21.2,35.2 22.2,34.2 R15.2
N$19
  Top 0.305: LED_2.B 20.4,33.8 21.2,33 22.2,33 22.6,32.6 R16.2
N$20
  Top 0.305: R14.1 26.6,31 28.6,29 | 28.6,29 SJ7.1 | R11.1 25.6,26 28.6,29
N$21  (via drill 0.5)
  Top 0.305: R15.1 28.6,34.2 | 28.6,34.2 SJ8.1 | R12.1 v26.8,24.4 | v28.8,33.2 28.8,34 28.6,34.2
  Bottom 0.305: v26.8,24.4 26.8,31.2 v28.8,33.2
N$22  (via drill 0.5)
  Top 0.305: R16.1 27.6,32.6 28.6,31.6 | 28.6,31.6 SJ9.1 | R13.1 26.8,22.8 v28.6,22.8 | v28.6,30.6 28.6,31.6
  Bottom 0.305: v28.6,22.8 v28.6,30.6
N$23
  Top 0.305: LED_2.A 20.4,30.4 19.8,29.8 18.2,29.8 17.6,30.4 17.6,35.4 19,36.8 SJ10.2
N$24
  Top 0.406: C6.A 71.8,18.7 D1.A 72.3,19.2 71,19.2 70.2,20 C5.1
N$25
  Top 0.305: 85.1,17.1 85.1,18.6
N$27
  Top 0.305: LED_1.A 18,25.6 16.8,26.8 16.8,37.2 19,39.4 SJ6.2
N$28
  Top 0.305: R10.1 32.15,47.15 32.4,47.4 32.4,47.91 SJ14.1
N$29
  Top 0.305: R10.2 28.75,48.85 28,49.6 25.4,49.6 23.8,48
  Top 0.406: IROUT.A 23.8,48
RESET  (via drill 0.6)
  Top 0.254: U1.13 61.6,39.2 62,38.8 62,38.4 62.2,38.2 62.4,38 U$1.13
  Top 0.305: S2.4 52.2,49.5 57.2,49.5 | S2.3 57.28,49.5 59.4,49.5 59.7,49.2 | R2.1 77.4,42.1
  Top 0.406: U1.13 59.3,39.2 58.1,40.4 58.1,43.1 59.3,44.3 | 59.3,44.3 59.3,48.8 59.7,49.2 59.9,49.2 72.1,49.2 72.4,48.9 75.6,48.9 76.3,48.2 76.3,43.5 77.25,42.55 R2.1 78.4,42.1 v78.7,41.8 | v60.3,42.8 60.3,43.3 59.3,44.3 | S2.3 57.25,49.6 57.3,49.6 | 57.3,49.6 57.5,49.6 57.4,49.7 57.2,49.7 57.3,49.6 | 57.3,49.6 57.3,49.3 57.2,49.4 57,49.4 57.1,49.5 57.2,49.5
  Bottom 0.406: J4.1 82.4,29.36 79.7,32.06 79.7,33.8 78.5,35 78.5,38.7 78.5,41.6 v78.7,41.8 79.9,43 JP3.5
RX-I  (via drill 0.6)
  Top 0.254: U1.20 61.4,33.6 62.2,34.4 62.3,34.5 U$1.20
  Top 0.406: U1.20 58.3,33.6 v57.4,32.7
  Bottom 0.406: v57.4,32.7 55.8,32.7 55.4,33.1 53.7,33.1 51.2,35.6 51.1,35.7 50.3,35.7 46.4,39.6 46.4,42 44.1,44.3 44.1,50.4 42.43,52.07 J1.1
RXLED  (via drill 0.6)
  Top 0.254: U1.8 64.8,40.8 65.4,40.2 U$1.8
  Top 0.406: R7.1 v54.2,19.2 | v64.8,43.8 U1.8
  Bottom 0.406: v64.8,43.8 66.1,42.5 67.1,41.5 67.1,26.6 66.1,25.6 66.1,23.8 61.5,19.2 60.9,18.6 57.2,18.6 54.8,18.6 v54.2,19.2
SCK  (via drill 0.6)
  Top 0.254: U1.9 64,41 64.8,40.2 64.9,40.1 U$1.9
  Top 0.305: v64,45.9 U1.9
  Bottom 0.254: JP5.5 93.8,30.53 93.8,47.2 92.7,48.3 88.9,48.3 81.7,48.3 80.46,47.06 JP3.3
  Bottom 0.305: v64,45.9 65.16,47.06 65.2,47.1 68.1,47.1 69.6,45.6 73.2,45.6 74,46.4 77.9,46.4 78.56,47.06 JP3.3
TX-O  (via drill 0.6)
  Top 0.254: U1.21 61.6,32.8 62,33.2 62,33.6 62.4,34 U$1.21
  Top 0.406: U1.21 58.8,32.8 v57.2,31.2
  Bottom 0.406: v57.2,31.2 56.3,31.2 55.1,32.4 53.3,32.4 50.8,34.9 50.1,34.9 45.7,39.3 45.7,41.6 43.4,43.9 43.4,48 41.95,49.45 | 41.95,49.45 41.9,49.5 41.9,49.4 | J1.2 41.91,49.49 41.95,49.45
TXLED  (via drill 0.6)
  Top 0.254: U1.22 61.5,32 U$1.22
  Top 0.406: U1.22 59.4,32 57.8,30.4 57.8,28.2 55.4,25.8 55.2,25.6 53.8,25.6 53,26.4 53,26.8 v53.4,27.2 | v51.8,20.6 R8.1
  Bottom 0.406: v53.4,27.2 53.4,22.6 53.4,22.2 v51.8,20.6
VBUS  (via drill 0.6)
  Top 0.254: U1.7 65.6,40.6 65.8,40.4 65.9,40.3 U$1.7 | C18.2 88.7,16.22
  Top 0.305: 69.25,16.8 F2.2 | v94.5,14.7 93.1,14.7 93,14.6 | v75.2,10.9 74.2,11.9 74.2,14.4 74.2,20.1 74.2,20.6 72.4,22.4 72.4,23 | v82.3,41 82.3,40.5 80.8,39 80.2,39 79.6,39.6 79.6,42.2 v78.2,43.6 | v65.6,44.6 U1.7
  Top 0.406: C18.2 88.64,16.04 88.64,14.8 | 88.64,14.8 CHARGE.A | U2.4 89.23,5.6 91,5.6 91.8,6.4 93.4,6.4 93.8,6.8 93.8,8.4 93,9.2 93,12 93,14.6 92.8,14.8 88.64,14.8 | 88.7,16.22 SJ2.1 | F2.2 69,22.8 69.4,23.2 72.2,23.2 72.4,23 D1.C
  Bottom 0.305: v75.2,10.9 76.9,10.9 79.2,13.2 93,13.2 v94.5,14.7 94.5,26.4 92.6,28.3 92.6,35.4 90.7,37.3 86,37.3 v82.3,41 | v78.2,43.6 74.4,43.6 73.9,43.6 73.2,44.3 69.1,44.3 68.2,45.2 66.2,45.2 v65.6,44.6
VCC  (via drill 0.6)
  Top 0.254: U1.2 69.6,40.8 69.2,40.4 68.8,40.4 68.4,40 U$1.2 | U1.34 71.3,32 U$1.34 | U1.14 61.4,38.4 62.2,37.6 62.3,37.5 U$1.14 | TX.A RX.A 54.2,4.8 55.5,3.5 58.8,3.5 59.4,4.1 59.4,11.9 v62.7,15.2 | v92.9,18.6 88.75,18.6 SJ2.2 | v71.6,48.3 71.4,48.3 | 81.2,43.1 81.2,47.8 82.44,49.04 JP3.2
  Top 0.305: C10.1 75.12,28.8 76.8,28.8 | C11.1 C12.1 78.72,29.6 77.6,29.6 77,29 L1.1 | C8.A 75,29 74.8,29.2 | 74.8,29.2 C10.1 | C10.1 74.8,28.8 C10.1 | C10.1 74.8,29.2 | U1.34 73.2,32 73.6,31.6 73.6,29.6 74,29.2 74.72,29.2 C10.1 | v85,35.7 86.7,35.7 86.75,35.75 | U1.14 58.8,38.4 57.3,39.9 57.3,43.2 57.3,43.6 v58.2,44.5 | v48.4,45.1 47.8,45.1 47.4,45.5 47.4,46.3 47.5,46.4 47.4,46.5 | 47.4,46.5 C9.1 | v80.6,40.1 80.6,42.5 81.1,43 81.2,43.1 | R2.2 75.55,48.15 75.4,48.3 v71.6,48.3 | 47.4,46.4 47.3,46.4 | 47.3,46.4 47,46.4 46.2,47.2 46.2,49.8 46.2,51.3 46.3,51.4 48.8,51.4 49.4,50.8 53.1,50.8 57.6,50.8 | 57.1,50.8 57.6,50.8 | 57.6,50.8 58.4,50.8 58.9,50.3 60.1,50.3 60.4,50 75.3,50 75.5,50 v77.2,48.3 | 47.4,46.5 47.3,46.4 | 70.7,43.9 70.7,43.8 70.7,43.9 | 70.7,43.9 C4.1
  Top 0.406: C11.1 83.53,29.52 84.2,30.2 84.2,33.2 85.85,34.85 86.75,35.75 87,36 90.8,36 92,34.8 92,28.5 J4.3 89.67,26.67 88.4,25.4 88.4,18.85 SJ2.2 85.05,18.55 SJ1.2 | L1.1 76.8,28.8 | SJ5.2 34.01,14.2 v36,14.2 | v39.4,8.6 39.4,6.8 40.4,5.8 46,5.8 51.2,5.8 51.5,6.1 TX.A | U1.2 69.6,42.8 70.7,43.9 | C4.1 71.22,43.92 71.7,44.4 71.7,48.2 v71.6,48.3
  Bottom 0.254: v62.7,15.2 70.7,15.2 73.9,12 76.9,12 78.8,13.9 90.9,13.9 92.9,15.9 v92.9,18.6 | v71.6,48.3 v77.2,48.3 81.1,48.3 81.2,48.4 82.4,49.6
  Bottom 0.305: v80.6,40.1 84.2,36.5 v85,35.7 | JP3.2 82.4,49.6
  Bottom 0.406: v36,14.2 39.4,10.8 v39.4,8.6 | v48.4,45.1 49.7,46.4 53.7,46.4 56.3,46.4 v58.2,44.5
VI
  Top 0.305: IC1.1 79.51,26.71 79.6,26.8 80.33,26.8 C7.1 82.78,26.88 F1.1
VIN
  Top 0.406: J4.6 90.08,34.2 86.4,34.2 85,32.8 85,24.2 84.35,23.55 F1.2 82.8,23.4 82.8,13.22 81.8,12.22 JP4.PWR
XTAL1
  Top 0.254: U$1.17 U1.17
  Top 0.305: U1.17 56.02,36 Q1.1 51.9,37.23 C15.1
XTAL2
  Top 0.254: U1.16 61.8,36.8 62,36.6 62.1,36.5 U$1.16
  Top 0.305: U1.16 58.4,36.8 56.4,38.8 54.8,40.4 Q1.2 | Q1.2 51.9,42.77 C16.1 | Q1.2 54.8,42.8 Q1.2

### Text on the board
tPlace: 0 | RX | A5 | Reset | 1 | 1 | TX | A4 | 2 | A3 | ~3 | A2 | 4 | ICSP | A1 | ~5 | A0 | ~6 | 7 | Vin | GND | 8 | GND | ~9 | 5V | ~10 | 3.3V | ~11 | RST | 12 | 13 | GND | ARF | SDA | SCL | 7-12V | Vin